# Altium schematic sheet Uc_Ticketing_Master.SchDoc
size A4; Organization: ETML-ES; Address1: Avenue Recordon 1; Address2: 1004 Lausanne; Address3: Switzerland
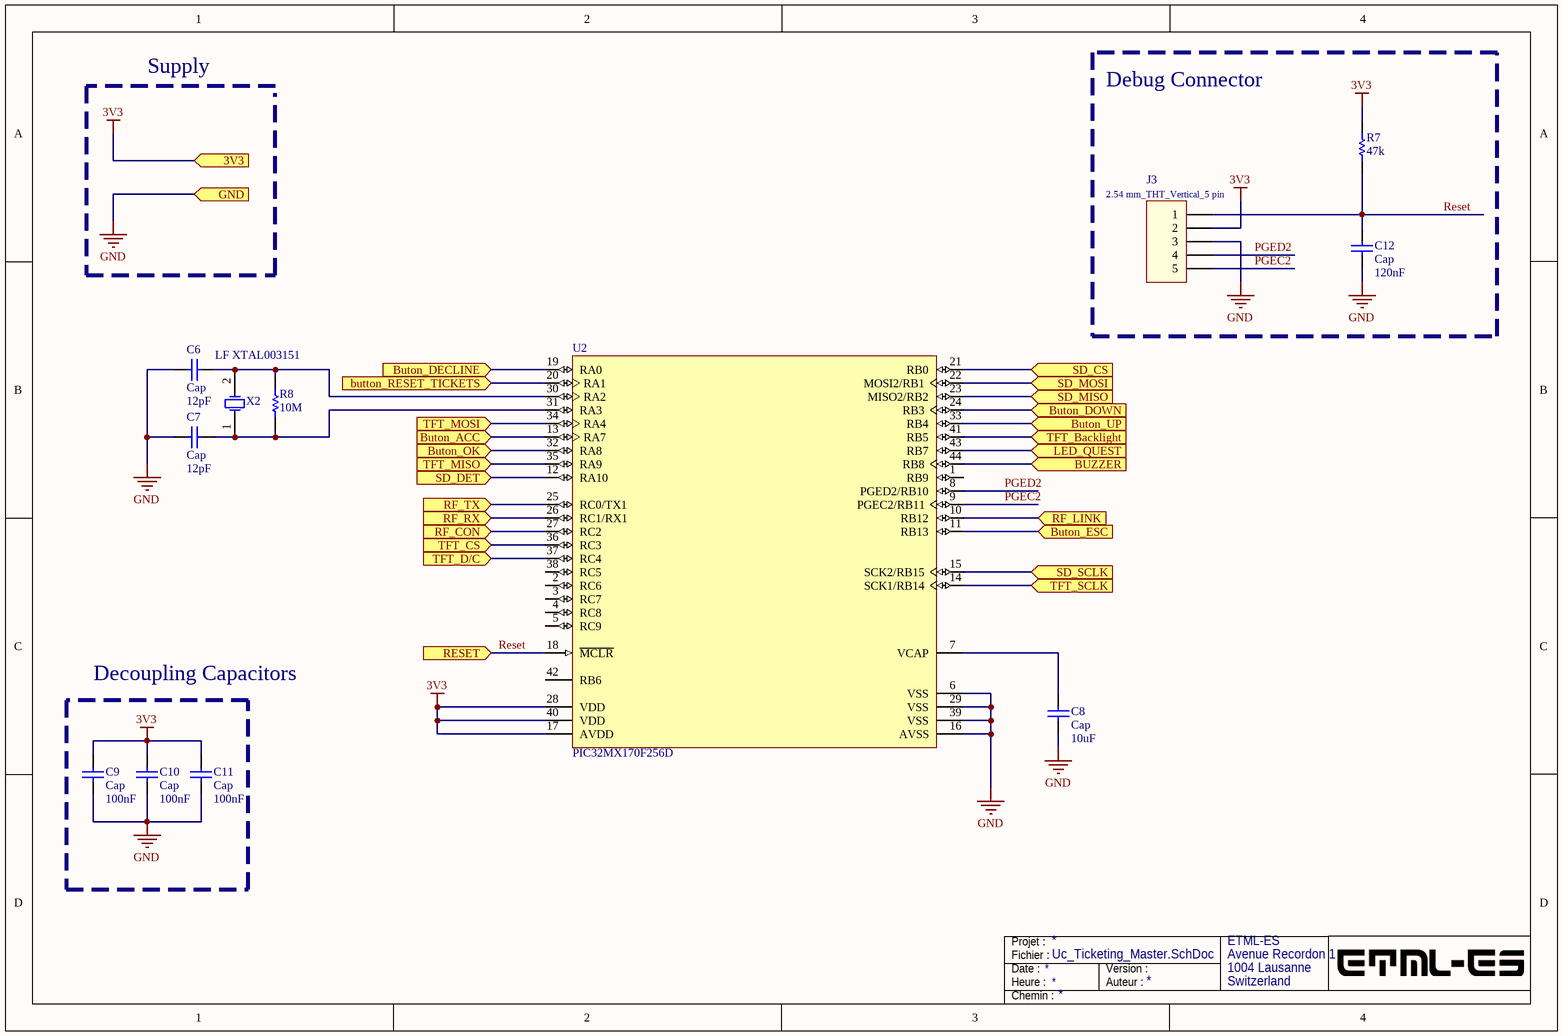
[diagram p0: Uc_Ticketing_Master.SchDoc]

## Parts
C6  Cap  value 12pF  [6-0805_N]
C7  Cap  value 12pF  [6-0805_N]
C8  Cap  value 10uF  [6-0805_N]
C9  Cap  value 100nF  [6-0805_N]
C10  Cap  value 100nF  [6-0805_N]
C11  Cap  value 100nF  [6-0805_N]
C12  Cap  value 120nF  [6-0805_N]
J3  2.54 mm_THT_Vertical_5 pin  [61300511121]
R7  47k  [RESC0805(2012)_L]
R8  10M  [RESC0805(2012)_L]
U2  PIC32MX170F256D  [MCHP-TQFP-PT44_N]
X2  LF XTAL003151  [ECS-80-18-5PX-TR_V]

## Blocks framed on the sheet
Debug Connector: C12 J3 R7
Decoupling Capacitors: C9-C11

## Ports
3V3, Buton_ACC, Buton_DECLINE, Buton_DOWN, Buton_ESC, Buton_OK, Buton_UP, button_RESET_TICKETS, BUZZER, GND, LED_QUEST, RESET, RF_CON, RF_LINK, RF_RX, RF_TX, SD_CS, SD_DET, SD_MISO, SD_MOSI, SD_SCLK, TFT_Backlight, TFT_CS, TFT_D/C, TFT_MISO, TFT_MOSI, TFT_SCLK

## Nets
3V3: C9.2 C10.2 C11.2 J3.2 R7.1 U2.17(AVDD) U2.28(VDD) U2.40(VDD) ; port 3V3
GND: C6.1 C7.2 C8.1 C9.1 C10.1 C11.1 C12.1 J3.3 U2.6(VSS) U2.16(AVSS) U2.29(VSS) U2.39(VSS) ; port GND
Buton_ACC: U2.13(RA7) ; port Buton_ACC
Buton_DECLINE: U2.19(RA0) ; port Buton_DECLINE
Buton_DOWN: U2.24(RB3) ; port Buton_DOWN
Buton_ESC: U2.11(RB13) ; port Buton_ESC
Buton_OK: U2.32(RA8) ; port Buton_OK
Buton_UP: U2.33(RB4) ; port Buton_UP
button_RESET_TICKETS: U2.20(RA1) ; port button_RESET_TICKETS
BUZZER: U2.44(RB8) ; port BUZZER
LED_QUEST: U2.43(RB7) ; port LED_QUEST
PGEC2: J3.5 U2.9(PGEC2/RB11)
PGED2: J3.4 U2.8(PGED2/RB10)
Reset: C12.2 J3.1 R7.2 U2.18(~{MCLR}) ; port RESET
RF_CON: U2.27(RC2) ; port RF_CON
RF_LINK: U2.10(RB12) ; port RF_LINK
RF_RX: U2.26(RC1/RX1) ; port RF_RX
RF_TX: U2.25(RC0/TX1) ; port RF_TX
SD_CS: U2.21(RB0) ; port SD_CS
SD_DET: U2.12(RA10) ; port SD_DET
SD_MISO: U2.23(MISO2/RB2) ; port SD_MISO
SD_MOSI: U2.22(MOSI2/RB1) ; port SD_MOSI
SD_SCLK: U2.15(SCK2/RB15) ; port SD_SCLK
TFT_Backlight: U2.41(RB5) ; port TFT_Backlight
TFT_CS: U2.36(RC3) ; port TFT_CS
TFT_D/C: U2.37(RC4) ; port TFT_D/C
TFT_MISO: U2.35(RA9) ; port TFT_MISO
TFT_MOSI: U2.34(RA4) ; port TFT_MOSI
TFT_SCLK: U2.14(SCK1/RB14) ; port TFT_SCLK
NetC6_2: C6.2 R8.2 U2.30(RA2) X2.2(X2)
NetC7_1: C7.1 R8.1 U2.31(RA3) X2.1(X1)
NetC8_2: C8.2 U2.7(VCAP)

Not connected (* = marked no-connect by the designer): U2 1(RB9) 2(RC6) 3(RC7) 4(RC8) 5(RC9) 38(RC5) 42(RB6)

## Notes on the sheet
- Supply
- Fichier :
- Date :
- Heure :
- Projet :
- Auteur :
- Version :
- Chemin :

## Library data of the parts
C6-C12 = Cap: Capacitor; Published: 8-Jun-2000; LatestRevisionDate: 17-Jul-2002; LatestRevisionNote: Re-released for DXP Platform.; PackageReference: RAD-0.3; Publisher: Altium Limited; PackageDescription: Radial Cap, Thru-Hole; 2 Leads; 0.3 in Pin Spacing
J3 = 61300511121: Pin Header WR-PHD, pitch 2.54 mm, THT, Vertical, single row, 5 pin; Rated Current: 3 A; Pin Number: 5; Pitch: 2.54 mm; Working Voltage: 250 VAC; Contact Resistance: 20 mOhm; Insulation Resistance: >1000 MOhm; ComponentLink1Description: Manufacturer; ComponentLink1URL: http://www.we-online.de; ComponentLink2Description: Datasheet; ComponentLink2URL: http://katalog.we-online.de/em/datasheet/6130xx11121.pdf; Part Number: 61300511121; Published Date: Jan. 2018; Publisher: Wurth Elektronik; Operating Temperature: -40 to 105 degC; Mounting Technology: THT; Row Number: Single; Orientation: Vertical
R7 = CMP-1013-00122-1: 100K 0.125W 5% 0805 (2012 Metric)  SMD; Case-Metric: 2012; Case-EIA: 0805; Tolerance: 5 %; Technology: SMT; Value: 47k; Power: 0.125 W
R8 = CMP-1013-00122-1: 100K 0.125W 5% 0805 (2012 Metric)  SMD; Case-Metric: 2012; Value: 47k; Case-EIA: 0805; Tolerance: 5 %; Technology: SMT; Power: 0.125 W
U2 = MCHP-PIC32MX2XXFXXXD-TQFP-44
X2 = CMP-2000-06193-1: Low Profile Quartz Crystal, 8.0 MHz, 2-Pin SMD, RoHS, Tape and Reel; Brand: ECS; Tolerance: 30PPM; Case Height: 4.3mm; Frequency: 8MHz; Frequency Stability: 50PPM; Case Length: 13.2mm; Case Width: 4.8mm; Load Capacitance: 18pF; Termination Style: SMD/SMT; Product Category: Crystals; Packaging: Reel; Package Reference: ECS-80-18-5PX-TR; Mounting Technology: SurfaceMount; Dimensions: 4.8mmWx13.2mmLx4.3mmH; Package Description: 2-Pin Surface Mount Device, Body 11.4 x 4.8 mm, Height 4.3 mm; Datasheet URL: https://www.ecsxtal.com/store/pdf/csm-7x.pdf; Datasheet Version: 05/2016; Manufacturer: ECS; Factory Pack Quantity: 1000; Manufacturer URL: https://www.ecsxtal.com/; Type: SMDQuartzCrystals; Mounting Style: SMD/SMT; Package / Case: HC-49/US; Operating Temperature Range: -10Cto+70C; RoHS: Details; Series: CSM-7X